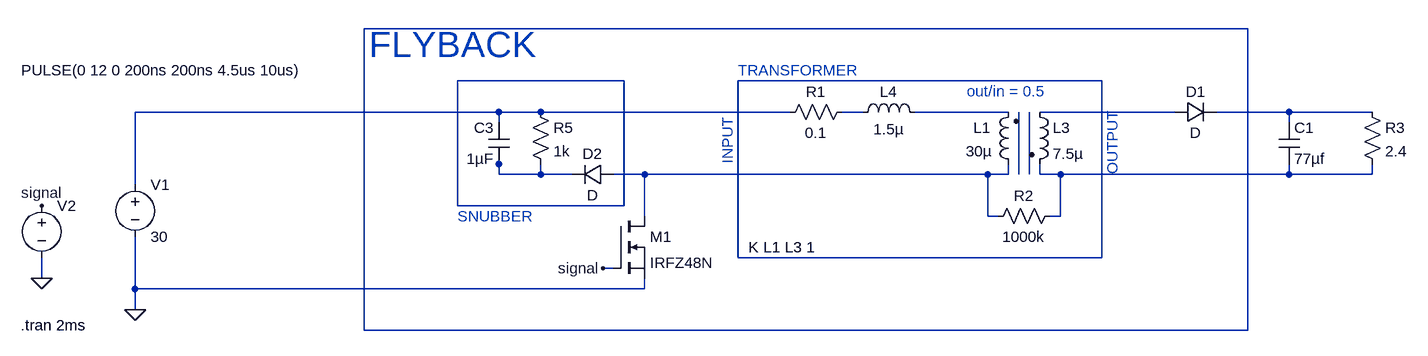
[diagram p0: schematic flyback_circuit.asc]
flyback_circuit.asc, the LTspice schematic file:
Version 4
SHEET 1 2028 680
WIRE 1776 -128 416 -128
WIRE 816 -48 560 -48
WIRE 1552 -48 992 -48
WIRE 624 0 64 0
WIRE 688 0 624 0
WIRE 1072 0 688 0
WIRE 1184 0 1152 0
WIRE 1408 0 1264 0
WIRE 1664 0 1456 0
WIRE 1840 0 1728 0
WIRE 1968 0 1840 0
WIRE 624 16 624 0
WIRE 1840 16 1840 0
WIRE 624 80 624 64
WIRE 624 96 624 80
WIRE 688 96 688 80
WIRE 688 96 624 96
WIRE 736 96 688 96
WIRE 848 96 800 96
WIRE 1376 96 848 96
WIRE 1408 96 1408 80
WIRE 1408 96 1376 96
WIRE 1424 96 1424 0
WIRE 1440 96 1440 0
WIRE 1456 96 1456 80
WIRE 1488 96 1456 96
WIRE 1840 96 1840 80
WIRE 1840 96 1488 96
WIRE 1968 96 1968 80
WIRE 1968 96 1840 96
WIRE 64 112 64 0
WIRE 560 144 560 -48
WIRE 816 144 816 -48
WIRE 816 144 560 144
WIRE 848 160 848 96
WIRE 1376 160 1376 96
WIRE 1392 160 1376 160
WIRE 1488 160 1488 96
WIRE 1488 160 1472 160
WIRE 992 224 992 -48
WIRE 1552 224 1552 -48
WIRE 1552 224 992 224
WIRE 800 240 784 240
WIRE -80 256 -80 224
WIRE 64 272 64 192
WIRE 848 272 848 256
WIRE 848 272 64 272
WIRE 64 304 64 272
WIRE 416 336 416 -128
WIRE 1776 336 1776 -128
WIRE 1776 336 416 336
FLAG 64 304 0
FLAG -80 256 0
FLAG -80 144 signal
FLAG 784 240 signal
SYMBOL voltage 64 96 R0
WINDOW 123 0 0 Left 0
WINDOW 39 0 0 Left 0
SYMATTR InstName V1
SYMATTR Value 30
SYMBOL nmos 800 160 R0
SYMATTR InstName M1
SYMATTR Value IRFZ48N
SYMBOL ind2 1424 96 R180
WINDOW 0 43 72 Left 2
WINDOW 3 41 36 Left 2
SYMATTR InstName L1
SYMATTR Value 30µ
SYMATTR Type ind
SYMATTR SpiceLine2 IC=0
SYMBOL ind2 1440 -16 R0
SYMATTR InstName L3
SYMATTR Value 7.5µ
SYMATTR Type ind
SYMBOL ind 1168 16 R270
WINDOW 0 32 56 VTop 2
WINDOW 3 5 56 VBottom 2
SYMATTR InstName L4
SYMATTR Value 1.5µ
SYMATTR SpiceLine2 IC=0
SYMBOL res 1168 -16 R90
WINDOW 0 0 56 VBottom 2
WINDOW 3 32 56 VTop 2
SYMATTR InstName R1
SYMATTR Value 0.1
SYMBOL voltage -80 128 R0
WINDOW 3 -31 -192 Left 2
WINDOW 123 0 0 Left 0
WINDOW 39 0 0 Left 0
SYMATTR Value PULSE(0 12 0 200ns 200ns 4.5us 10us)
SYMATTR InstName V2
SYMBOL res 1488 144 R90
WINDOW 0 0 56 VBottom 2
WINDOW 3 32 56 VTop 2
SYMATTR InstName R2
SYMATTR Value 1000k
SYMBOL cap 1824 16 R0
SYMATTR InstName C1
SYMATTR Value 77µf
SYMATTR SpiceLine2 IC=12
SYMBOL res 1952 -16 R0
SYMATTR InstName R3
SYMATTR Value 2.4
SYMBOL diode 1664 16 R270
WINDOW 0 32 32 VTop 2
WINDOW 3 0 32 VBottom 2
SYMATTR InstName D1
SYMBOL cap 640 80 R180
WINDOW 0 24 56 Left 2
WINDOW 3 24 8 Left 2
SYMATTR InstName C3
SYMATTR Value 1µF
SYMBOL diode 800 80 R90
WINDOW 0 0 32 VBottom 2
WINDOW 3 32 32 VTop 2
SYMATTR InstName D2
SYMBOL res 672 -16 R0
SYMATTR InstName R5
SYMATTR Value 1k
TEXT 976 8 VRight 2 ;INPUT
TEXT 1568 96 VLeft 2 ;OUTPUT
TEXT 1344 -32 Left 2 ;out/in = 0.5
TEXT 1008 208 Left 2 !K L1 L3 1
TEXT -112 328 Left 2 !.tran 2ms
TEXT 424 -104 Left 5 ;FLYBACK
TEXT 992 -64 Left 2 ;TRANSFORMER
TEXT 560 160 Left 2 ;SNUBBER

The netlist it stands for:
* flyback_circuit.asc
V1 N004 0 30
M1 N010 signal 0 0 IRFZ48N
L1 N010 N006 30µ IC=0
L3 N007 N013 7.5µ
L4 N005 N006 1.5µ IC=0
R1 N005 N004 0.1
V2 signal 0 PULSE(0 12 0 200ns 200ns 4.5us 10us)
R2 N013 N010 1000k
C1 N008 N013 77µf IC=12
R3 N008 N013 2.4
D1 N007 N008 D
C3 N009 N004 1µF
D2 N010 N009 D
R5 N004 N009 1k
.model D D
.lib standard.dio
.model NMOS NMOS
.model PMOS PMOS
.lib standard.mos
* INPUT
* OUTPUT
* out/in = 0.5
K L1 L3 1
.tran 2ms
* FLYBACK
* TRANSFORMER
* SNUBBER
.backanno
.end